# EAGLE schematic TCSB (EAGLE 7.7.0)
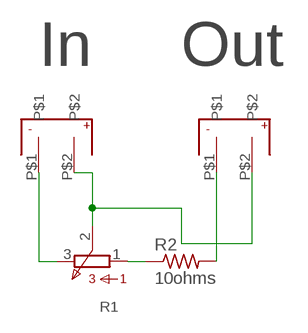
[diagram p0: schematic, sheet 1]

## Parts
R1  308/309  [308]
R2  10ohms  R-US_0204/7  [0204/7]
U$1  RCA-YELLOW  [RCA-YELLOW]
U$2  RCA-YELLOW  [RCA-YELLOW]

## Nets
N$1: R2.2 U$2.P$1
N$2: R1.2 U$1.P$2 U$2.P$2
N$3: R1.3 U$1.P$1
N$4: R1.1 R2.1

## Notes on the sheet
- In | Out

## Library data of the parts
R1 = bourns:308/309: 308/309 Series Potentiometer
R2 = adafruit:R-US_: RESISTOR, American symbol
U$1 U$2 = con-rca:RCA-YELLOW